# Altium schematic sheet ConnectorPMOD.SchDoc: PCB_Conectores
size A4; Author: Jose Luis Llorente Gonzalez; CompanyName: ETSIT; Organization: UPM; Revision: V1.0
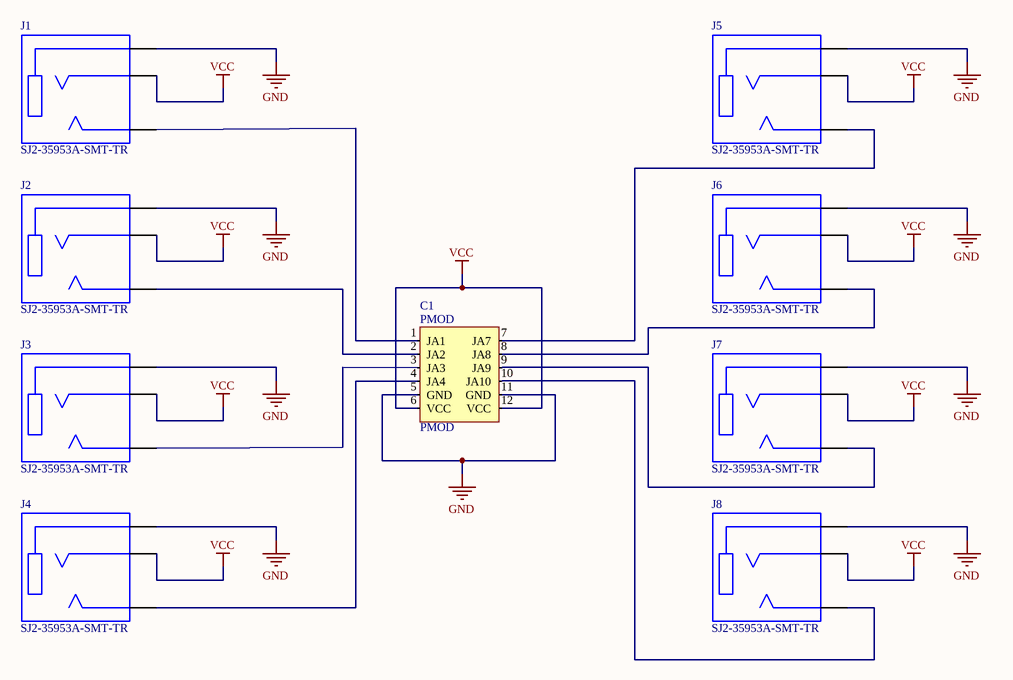
[diagram p0: ConnectorPMOD.SchDoc]

## Parts
C1  PMOD  [PMOD]
J1  SJ2-35953A-SMT-TR  [CUI_SJ2-35953A-SMT-TR]
J2  SJ2-35953A-SMT-TR  [CUI_SJ2-35953A-SMT-TR]
J3  SJ2-35953A-SMT-TR  [CUI_SJ2-35953A-SMT-TR]
J4  SJ2-35953A-SMT-TR  [CUI_SJ2-35953A-SMT-TR]
J5  SJ2-35953A-SMT-TR  [CUI_SJ2-35953A-SMT-TR]
J6  SJ2-35953A-SMT-TR  [CUI_SJ2-35953A-SMT-TR]
J7  SJ2-35953A-SMT-TR  [CUI_SJ2-35953A-SMT-TR]
J8  SJ2-35953A-SMT-TR  [CUI_SJ2-35953A-SMT-TR]

## Nets
GND: C1.5(GND) C1.11(GND) J1.1(SLEEVE) J2.1(SLEEVE) J3.1(SLEEVE) J4.1(SLEEVE) J5.1(SLEEVE) J6.1(SLEEVE) J7.1(SLEEVE) J8.1(SLEEVE)
VCC: C1.6(VCC) C1.12(VCC) J1.3(RING1) J2.3(RING1) J3.3(RING1) J4.3(RING1) J5.3(RING1) J6.3(RING1) J7.3(RING1) J8.3(RING1)
NetC1_1: C1.1(JA1) J1.2(TIP)
NetC1_2: C1.2(JA2) J2.2(TIP)
NetC1_3: C1.3(JA3) J3.2(TIP)
NetC1_4: C1.4(JA4) J4.2(TIP)
NetC1_7: C1.7(JA7) J5.2(TIP)
NetC1_8: C1.8(JA8) J6.2(TIP)
NetC1_9: C1.9(JA9) J7.2(TIP)
NetC1_10: C1.10(JA10) J8.2(TIP)

## Notes on the sheet
- Title
- Size:
- Date:
- A4
- Number:
- Time:
- Revision:
- Sheet
- of
- File:

## Library data of the parts
J1-J8 = SJ2-35953A-SMT-TR: 3.5 mm, Stereo, Right Angle, Surface Mount _SMT_, Audio Jack Connector; MF: CUI Devices; Price: None; Availability: Unavailable; SnapEDA_Link: https://www.snapeda.com/parts/SJ2-35953A-SMT-TR/CUI%20Devices/view-part/701771/?ref=snap; MP: SJ2-35953A-SMT-TR; CUI_purchase_URL: https://www.cuidevices.com/product/interconnect/connectors/audio-connectors/jacks/sj2-3595x-smt-series?utm_source=snapeda.com&utm_medium=referral&utm_campaign=snapedaBOM; Value: *; Package: None